# EAGLE design generator_cd4047_trafo_ct (EAGLE 7.2.0)
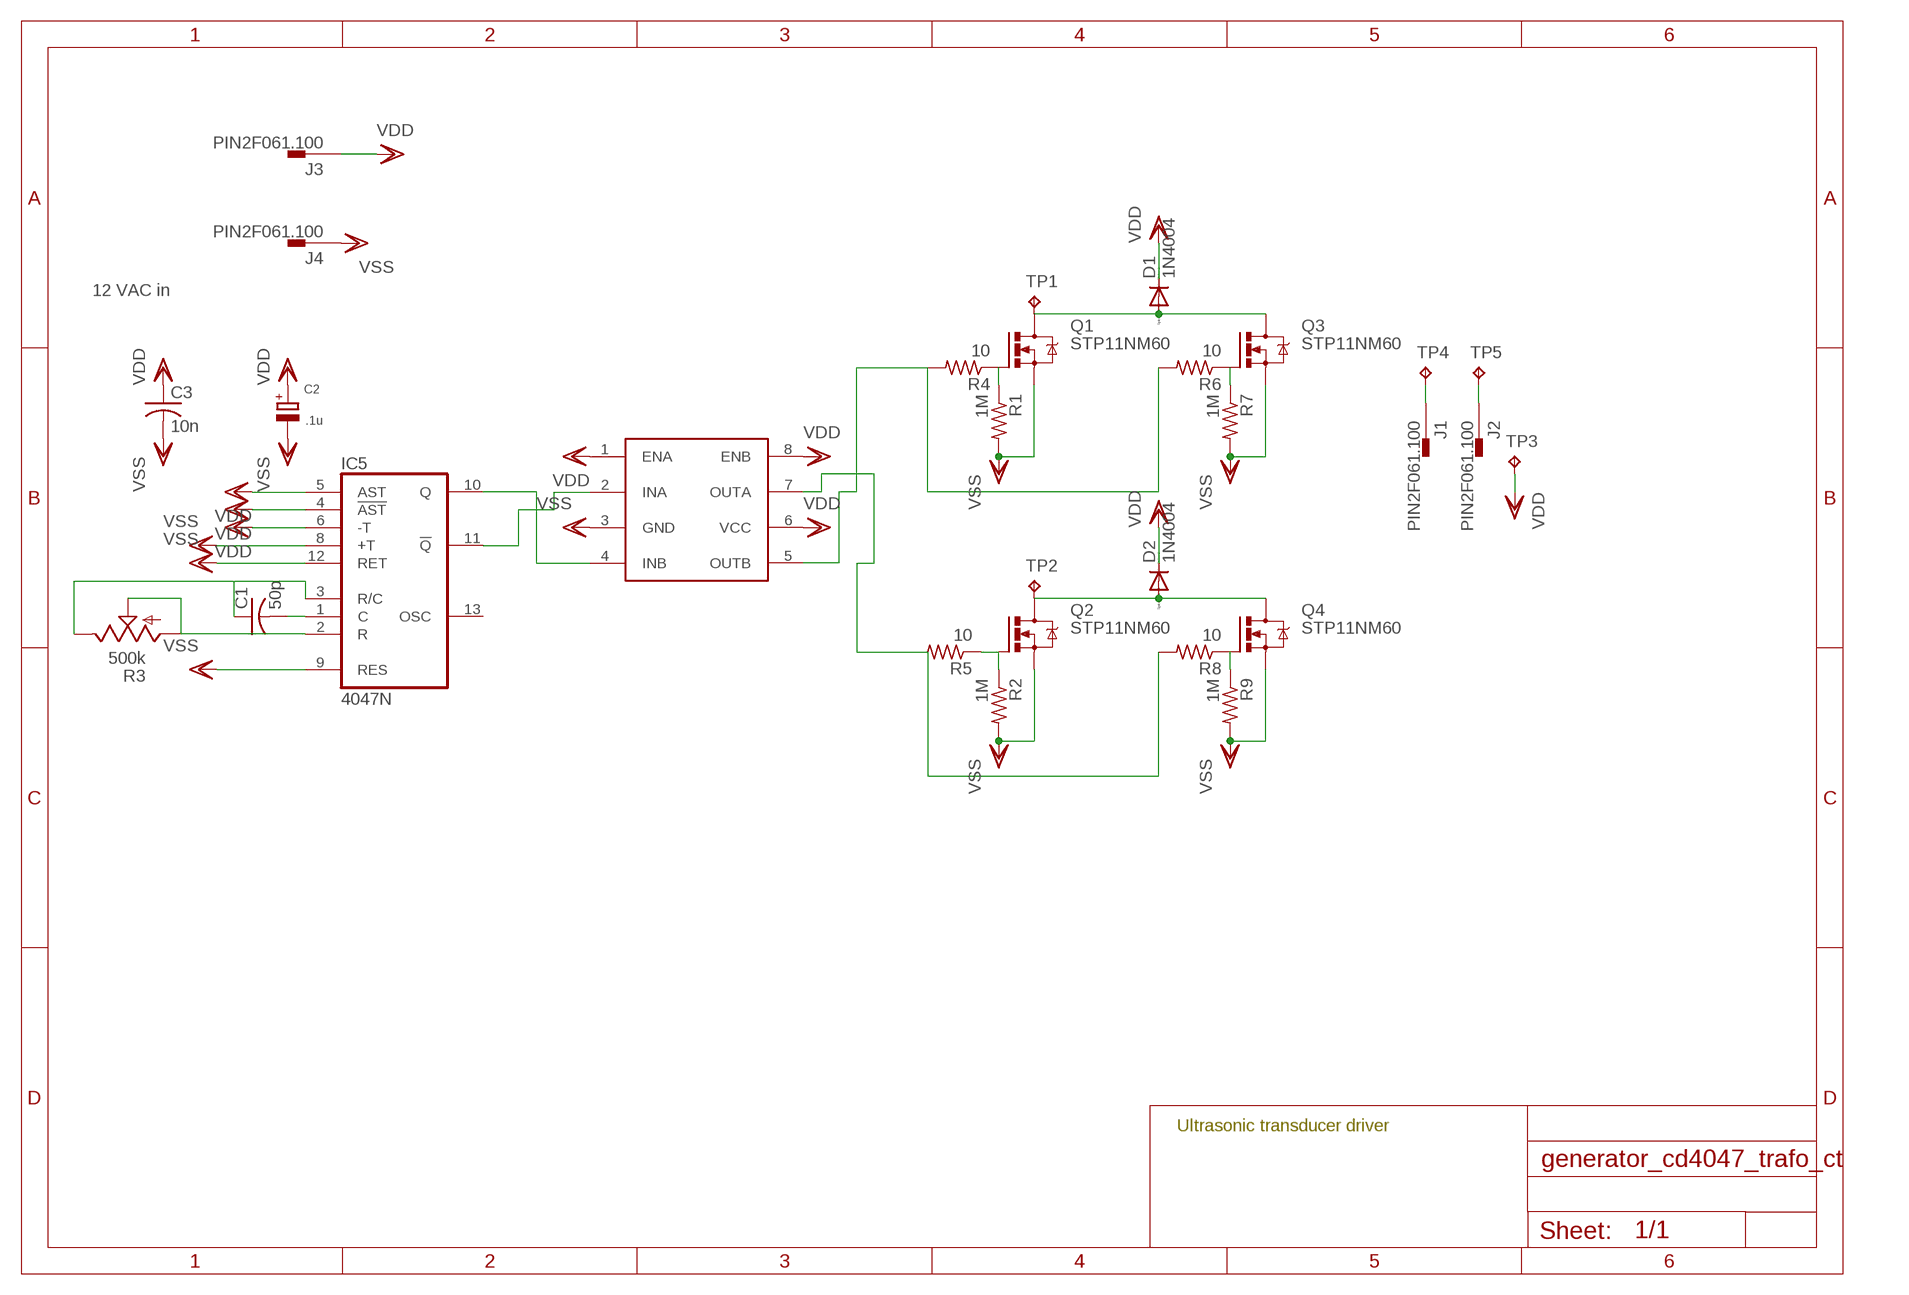
[diagram p0: schematic, sheet 1]

## Parts
C1  50p  C-US075-042X103  [C075-042X103]
C2  .1u  CPOL-EUE5-8.5  [E5-8,5]
C3  10n  C-US075-042X103  [C075-042X103]
D1  1N4004  [DO41-10]
D2  1N4004  [DO41-10]
IC5  4047N  [DIL14]
J1  PIN2F061.100  [F061.100]
J2  PIN2F061.100  [F061.100]
J3  PIN2F061.100  [F061.100]
J4  PIN2F061.100  [F061.100]
Q1  STP11NM60  IRF530  [TO220BV]
Q2  STP11NM60  IRF530  [TO220BV]
Q3  STP11NM60  IRF530  [TO220BV]
Q4  STP11NM60  IRF530  [TO220BV]
R1  1M  R-US_0207/10  [0207/10]
R2  1M  R-US_0207/10  [0207/10]
R3  500k  TRIM_US-RJ9W  [RJ9W]
R4  10  R-US_0207/10  [0207/10]
R5  10  R-US_0207/10  [0207/10]
R6  10  R-US_0207/10  [0207/10]
R7  1M  R-US_0207/10  [0207/10]
R8  10  R-US_0207/10  [0207/10]
R9  1M  R-US_0207/10  [0207/10]
TP1  TPPAD1-20Y  [P1-20Y]
TP2  TPPAD1-20Y  [P1-20Y]
TP3  TPPAD1-20Y  [P1-20Y]
TP4  TPPAD1-13Y  [P1-13Y]
TP5  TPPAD1-13Y  [P1-13Y]
U$1  UCC27425  [DIL08]

## Nets
N$1: R5.2 R8.2 U$1.7(OUTA)
N$2: IC5.2(R) R3.A R3.S
N$3: C1.1 IC5.3(R/C) R3.E
N$4: C1.2 IC5.1(C)
N$5: Q4.G R8.1 R9.1
N$6: D2.A Q2.D Q4.D TP2.TP
N$7: IC5.11(!Q) U$1.2(INA)
N$8: J1.A1 J1.A2 TP4.TP
N$9: J2.A1 J2.A2 TP5.TP
N$10: Q3.G R6.1 R7.1
N$11: Q2.G R2.1 R5.1
N$12: Q1.G R1.1 R4.1
N$13: R4.2 R6.2 U$1.5(OUTB)
N$14: D1.A Q1.D Q3.D TP1.TP
N$17: IC5.10(Q) U$1.4(INB)
VDD: C2.+ C3.1 D1.C D2.C IC5.4(!AST) IC5.5(AST) IC5.6(-T) J3.A1 J3.A2 TP3.TP U$1.1(ENA) U$1.6(VCC) U$1.8(ENB)
VSS: C2.- C3.2 IC5.8(+T) IC5.9(RES) IC5.12(RET) J4.A1 J4.A2 Q1.S Q2.S Q3.S Q4.S R1.2 R2.2 R7.2 R9.2 U$1.3(GND)
Unconnected: IC5.13(OSC)

## Notes on the sheet
- 12 VAC in
- Ultrasonic transducer driver

## Power pins joined to a net without a drawn wire
VDD: IC5.14(VDD)
VSS: IC5.7(VSS)

## Library data of the parts
C1 C3 = rcl:C-US: CAPACITOR, American symbol
C2 = rcl:CPOL-EU: POLARIZED CAPACITOR, European symbol
D1 D2 = diode:1N4004: DIODE general purpose rectifier, 1 A
IC5 = 40xx:4047: LP monostable/astable MULTIVIBRATOR
J1-J4 = con-faston:PIN2: Flachstecker Typ Tyco/Electronics/AMP TAB, FASTON Printed Circuit Board Tabs Source: http://www.buerklin.com, http://catalog.tycoelectronics.com; OC_FARNELL: unknown; OC_NEWARK: unknown
Q1-Q4 = transistor-power:IRF530: HEXFET Power MOSFET
R1 R2 R4-R9 = rcl:R-US_: RESISTOR, American symbol
R3 = pot:TRIM_US-: POTENTIOMETER
TP1-TP5 = testpad:TP: Test pad
U$1 = texas:UCC27425

## Board
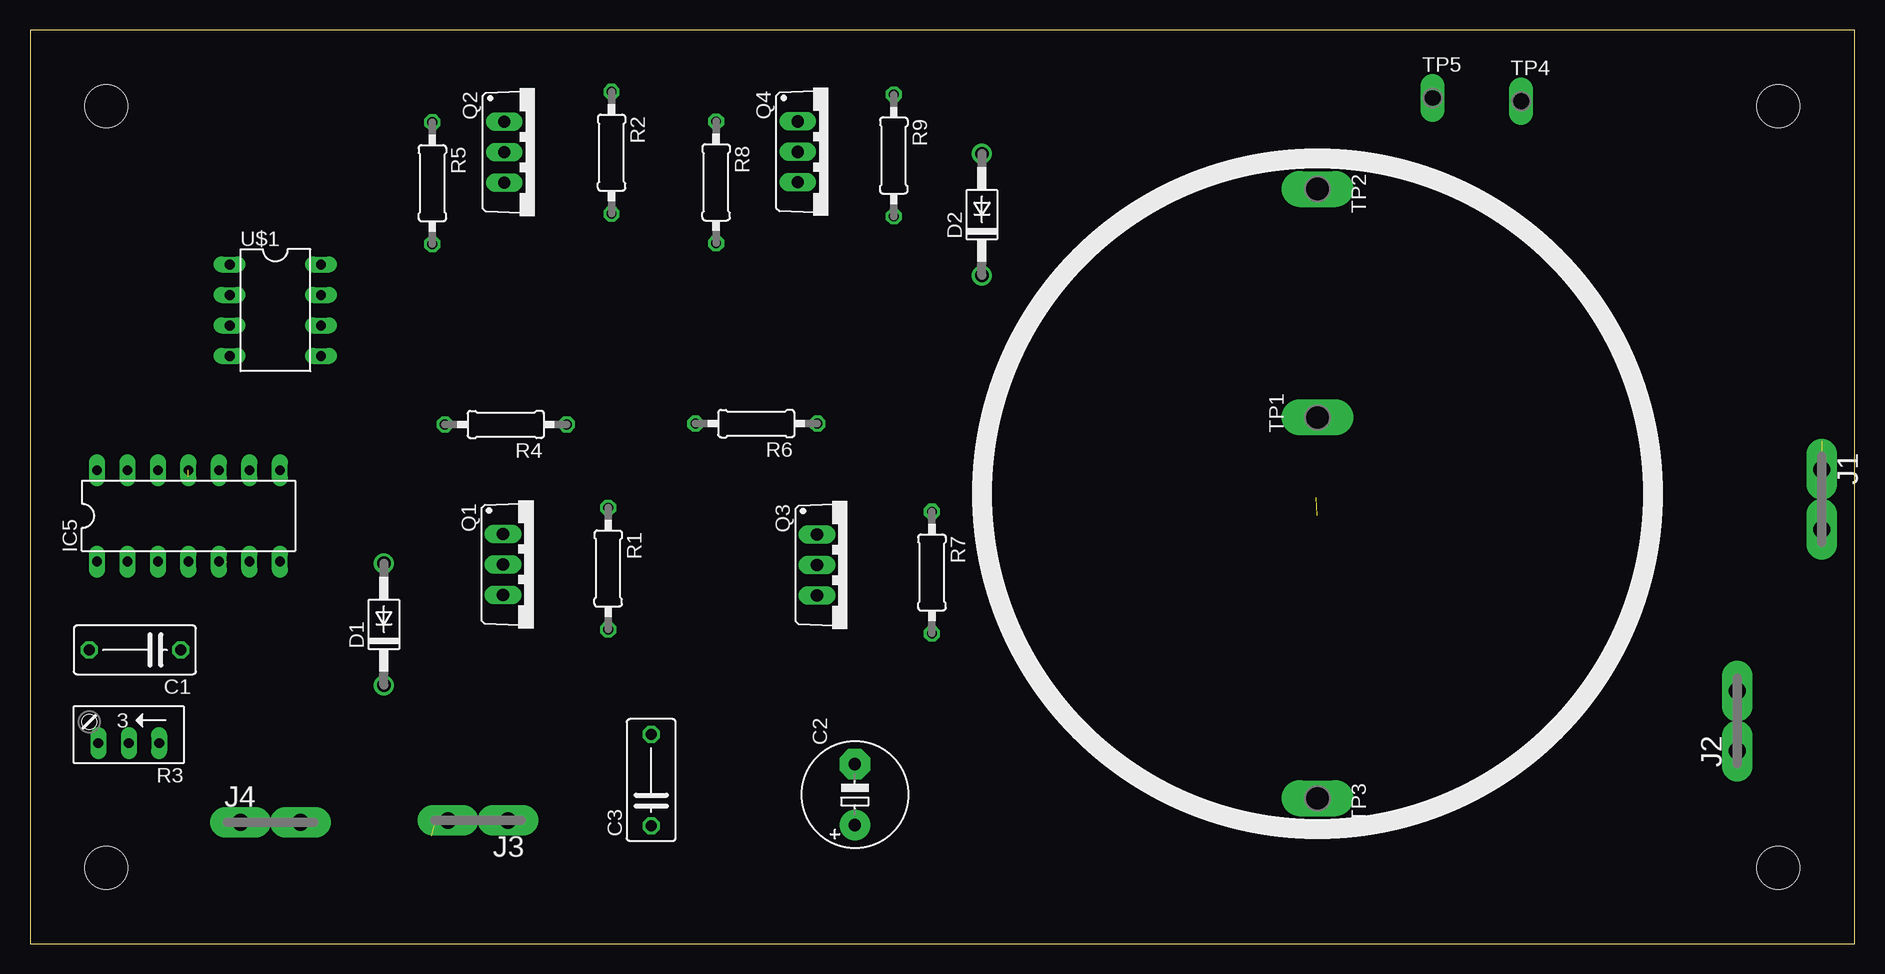
[diagram p1: board, top side]
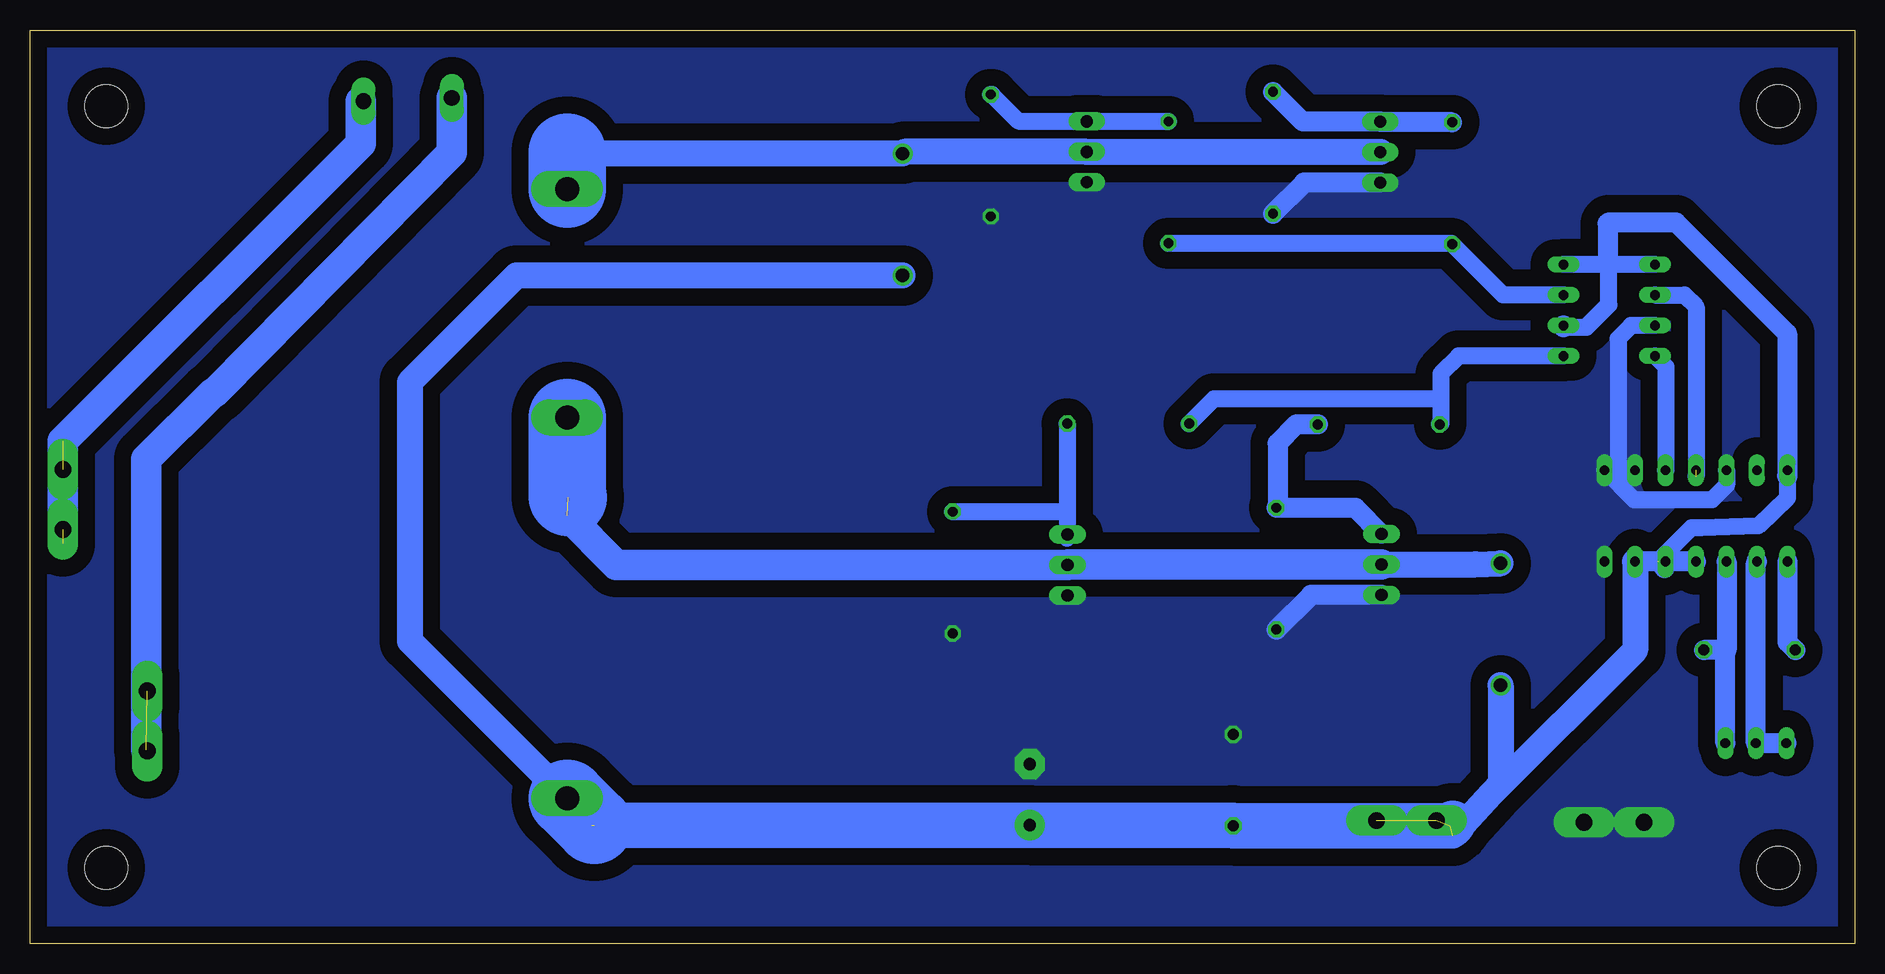
[diagram p2: board, bottom side, seen from below]

Size 152.04 x 76.2 mm. Coordinates in mm from the lower left corner, seen from the top.
Outline: 0,0 152.04,0 152.04,76.2 0,76.2 0,0
Copper layers (1*16): Top 0.035mm / dielectric 1.5mm / Bottom 0.035mm
Design rules "default *": minimum track width 10mil, minimum drill 24mil, track to track 8mil, track to pad 8mil, pad to pad 8mil, via to via 8mil, smd to smd 8mil, copper to edge 5mil, drill to drill 8mil, minimum pad ring 10mil, minimum via ring 8mil, stop-mask expansion 4mil, vias tented up to drill 0mil, thermal gap 10mil
Holes 3.56 mm at 6.35,6.35 145.69,69.85 145.69,6.35 6.35,69.85

### Footprints (pad centres in the part's own frame; a part is rotated, then mirrored left to right if it is on the bottom)
C075-042X103 = drill 0.914 octagon: 1 -3.81,0; 2 3.81,0
E5-8,5 = drill 1.016 pad 2.54: + -2.54,0 | drill 1.016 pad 2.54 octagon: - 2.54,0
DO41-10 = drill 1.118: A 5.08,0; C -5.08,0
DIL14 = drill 0.813 long: 1 -7.62,-3.81; 2 -5.08,-3.81; 3 -2.54,-3.81; 4 0,-3.81; 5 2.54,-3.81; 6 5.08,-3.81; 7 7.62,-3.81; 8 7.62,3.81; 9 5.08,3.81; 10 2.54,3.81; 11 0,3.81; 12 -2.54,3.81; 13 -5.08,3.81; 14 -7.62,3.81
F061.100 = drill 1.4 pad 2.54 long: A1 -2.5,0; A2 2.5,0
TO220BV = drill 1.016 long: D 0,-2.54; G -2.54,-2.54; S 2.54,-2.54
0207/10 = drill 0.813 octagon: 1 -5.08,0; 2 5.08,0
RJ9W = drill 0.813 long: A 2.54,0.635; E -2.54,0.635; S 0,0.635
P1-20Y = drill 2.007 pad 2.54 long: TP 0,0
P1-13Y = drill 1.321 pad 1.905 long: TP 0,0
DIL08 = drill 0.813 long: 1 -3.81,-3.81; 2 -1.27,-3.81; 3 1.27,-3.81; 4 3.81,-3.81; 5 3.81,3.81; 6 1.27,3.81; 7 -1.27,3.81; 8 -3.81,3.81

### Placement (x,y rotation side)
C1  8.74,24.51 180 top
C2  68.73,12.45 90 top
C3  51.77,13.67 90 top
D1  29.49,26.64 90 top
D2  79.32,60.81 90 top
IC5  13.21,35.69 0 top
J1  149.3,37.06 270 top
J2  142.27,18.59 90 top
J3  37.34,10.29 180 top
J4  20.04,10.13 0 top
Q1  41.96,31.65 270 top
Q2  42.06,66.01 270 top
Q3  68.12,31.6 270 top
Q4  66.52,66.04 270 top
R1  48.18,31.29 270 top
R2  48.46,65.96 270 top
R3  8.23,17.37 180 top
R4  39.65,43.31 180 top
R5  33.53,63.42 270 top
R6  60.53,43.38 180 top
R7  75.16,30.96 270 top
R8  57.18,63.5 270 top
R9  71.98,65.74 270 top
TP1  107.29,43.89 90 top
TP2  107.29,62.94 270 top
TP3  107.29,12.14 270 top
TP4  124.26,70.26 0 top
TP5  116.89,70.54 0 top
U$1  20.45,52.83 270 top

### Tracks (layer width: path | path; a pad name or v marks a point on that pad's centre or on a via)
N$1
  Bottom 1.422: R8.2 33.6,58.42 R5.2 29.29,54.1 U$1.7
N$2
  Bottom 1.676: R3.A R3.S 8.23,31.77 IC5.2
N$3
  Bottom 1.676: R3.E 10.77,24.46 C1.1 10.67,24.51 IC5.3
N$4
  Bottom 1.676: IC5.1 5.59,25.17 C1.2
N$5
  Bottom 1.422: R9.1 71.88,70.81 69.67,68.61 64.01,68.61 Q4.G R8.1
N$6
  Bottom 2.184: Q2.D 63.96,66.02 Q4.D 79.17,66.04 D2.A 107.21,65.89 107.29,65.96
  Bottom 6.452: 107.29,66.02 107.29,65.96 TP2.TP
N$7  (1 unrouted)
  Bottom 1.422: U$1.2 14.17,54.1 13.21,53.14 13.21,38.99
N$8  (2 unrouted)
  Bottom 1.676: TP4.TP 124.47,70.26
  Bottom 2.54: 124.47,70.26 124.47,66.74 149.3,41.91 149.3,33.4
N$9  (1 unrouted)
  Bottom 2.54: TP5.TP 116.89,65.96 136.53,46.1 136.93,45.82 142.34,40.41 142.34,16.17 J2.A1
N$10
  Bottom 1.422: R6.1 65.61,36.02 | 65.61,36.02 65.61,33.83 Q3.G | R7.1 65.63,36.04 65.61,36.02
N$11
  Bottom 1.676: R2.1 45.97,68.56 Q2.G 39.5,68.53 R5.1
N$12
  Bottom 1.676: R4.1 46.51,43.31 48.08,41.73 48.08,36.47 R1.1 41.6,36.37 Q1.G
N$13
  Bottom 1.422: 34.57,43.36 R4.2 34.47,43.41 34.47,45.41 | 34.47,45.41 53.39,45.44 R6.2 | U$1.5 32.99,49.02 34.47,47.55 34.47,45.41
N$14  (1 unrouted)
  Bottom 1.422: 65.53,31.65 Q3.D
  Bottom 2.184: Q1.D 31.6,31.65 D1.A
  Bottom 2.54: Q1.D 65.53,31.65 | Q3.D 103.17,31.6 107.29,35.71
  Bottom 6.452: TP1.TP 107.29,37.31 107.19,37.21
N$17
  Bottom 1.422: U$1.4 16.61,49.02 15.72,48.13 15.72,39.52 IC5.10
VDD  (5 unrouted)
  Bottom 1.422: U$1.1 20.47,56.64 | 20.47,56.64 U$1.8 | 24.26,51.41 22.33,51.41 | 22.33,51.41 20.47,53.26 20.47,56.39 20.47,56.64 | 22.33,51.41 22.33,51.51 20.57,53.26 | 20.57,60.07 20.47,60.17 | 5.61,39.01 5.59,38.99 5.59,37.19 8.03,34.85 12.8,34.7 13.59,34.7 16.41,31.88
  Bottom 1.676: IC5.14 5.59,38.99 | IC5.6 16.41,31.88 IC5.5 IC5.4 15.7,31.88 15.75,31.93 | 16.33,31.85 15.82,31.34 | U$1.6 24.26,51.41 | 20.47,60.17 14.88,60.17 5.61,50.9 5.61,39.01 | 20.57,60.07 20.57,56.49 20.47,56.39
  Bottom 2.184: 105.23,9.91 105.77,9.37 | D1.C 29.49,13.36 30.32,12.46 | 30.32,12.46 33.48,9.02 | D2.C 111.51,55.73 120.4,46.84 120.4,25.25 TP3.TP | IC5.6 18.29,24.49 30.32,12.46
  Bottom 3.81: 105.23,9.91 C2.+ 51.82,9.91 C3.1 33.71,9.86 33.5,10.06
  Bottom 6.452: 105.03,9.88 TP3.TP
VSS
  Bottom 1.422: U$1.3 18.62,51.56 19.71,50.47 19.71,39.14 | IC5.12 10.67,38.25 11.89,37.03 18.36,37.03 IC5.8
  Bottom 1.676: Q2.S 45.87,63.48 R2.2 | Q1.S 45.29,29.11 R1.2
  Bottom 2.184: 19.71,39.14 19.46,38.89
  pour Bottom (isolate 1.422, no thermals): 0,76.17 152.04,76.2 152.04,0 0.05,0